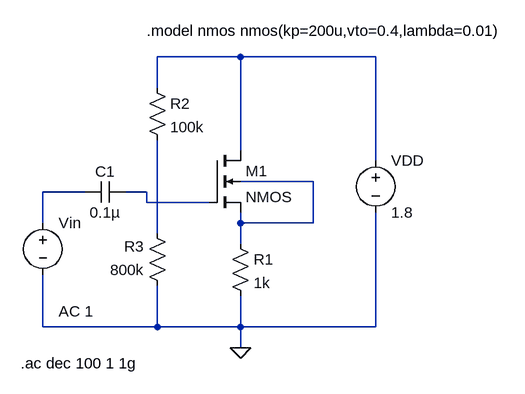
[diagram p0: schematic cd amplifier.asc]
cd amplifier.asc, the LTspice schematic file:
Version 4
SHEET 1 880 680
WIRE 192 -16 64 -16
WIRE 400 -16 192 -16
WIRE 64 32 64 -16
WIRE 192 128 192 -16
WIRE 400 144 400 -16
WIRE 304 176 192 176
WIRE -48 192 -112 192
WIRE 48 192 16 192
WIRE 48 208 48 192
WIRE 144 208 48 208
WIRE -112 240 -112 192
WIRE 192 240 192 224
WIRE 304 240 304 176
WIRE 304 240 192 240
WIRE 64 256 64 112
WIRE 192 272 192 240
WIRE -112 400 -112 320
WIRE 64 400 64 336
WIRE 64 400 -112 400
WIRE 192 400 192 352
WIRE 192 400 64 400
WIRE 400 400 400 224
WIRE 400 400 192 400
WIRE 192 432 192 400
FLAG 192 432 0
SYMBOL voltage 400 128 R0
SYMATTR InstName VDD
SYMATTR Value 1.8
SYMBOL voltage -112 224 R0
WINDOW 123 24 152 Left 2
WINDOW 39 24 124 Left 2
SYMATTR InstName Vin
SYMATTR Value ""
SYMATTR Value2 AC 1
SYMBOL nmos4 144 128 R0
SYMATTR InstName M1
SYMATTR Value2 l=1u w=100u
SYMBOL res 176 256 R0
SYMATTR InstName R1
SYMATTR Value 1k
SYMBOL res 48 16 R0
SYMATTR InstName R2
SYMATTR Value 100k
SYMBOL res 80 352 R180
WINDOW 0 36 76 Left 2
WINDOW 3 36 40 Left 2
SYMATTR InstName R3
SYMATTR Value 800k
SYMBOL cap 16 176 R90
WINDOW 0 0 32 VBottom 2
WINDOW 3 32 32 VTop 2
SYMATTR InstName C1
SYMATTR Value 0.1µ
TEXT 48 -56 Left 2 !.model nmos nmos(kp=200u,vto=0.4,lambda=0.01)
TEXT -146 456 Left 2 !.ac dec 100 1 1g

The netlist it stands for:
* cd amplifier.asc
VDD N001 0 1.8
Vin N003 0 AC 1
M1 N001 N004 N002 N002 NMOS l=1u w=100u
R1 N002 0 1k
R2 N001 N005 100k
R3 0 N005 800k
C1 N004 N003 0.1µ
.model NMOS NMOS
.model PMOS PMOS
.lib standard.mos
.model nmos nmos(kp=200u,vto=0.4,lambda=0.01)
.ac dec 100 1 1g
.backanno
.end